# EAGLE design sensorboard_18_v7 (EAGLE 7.7.0)
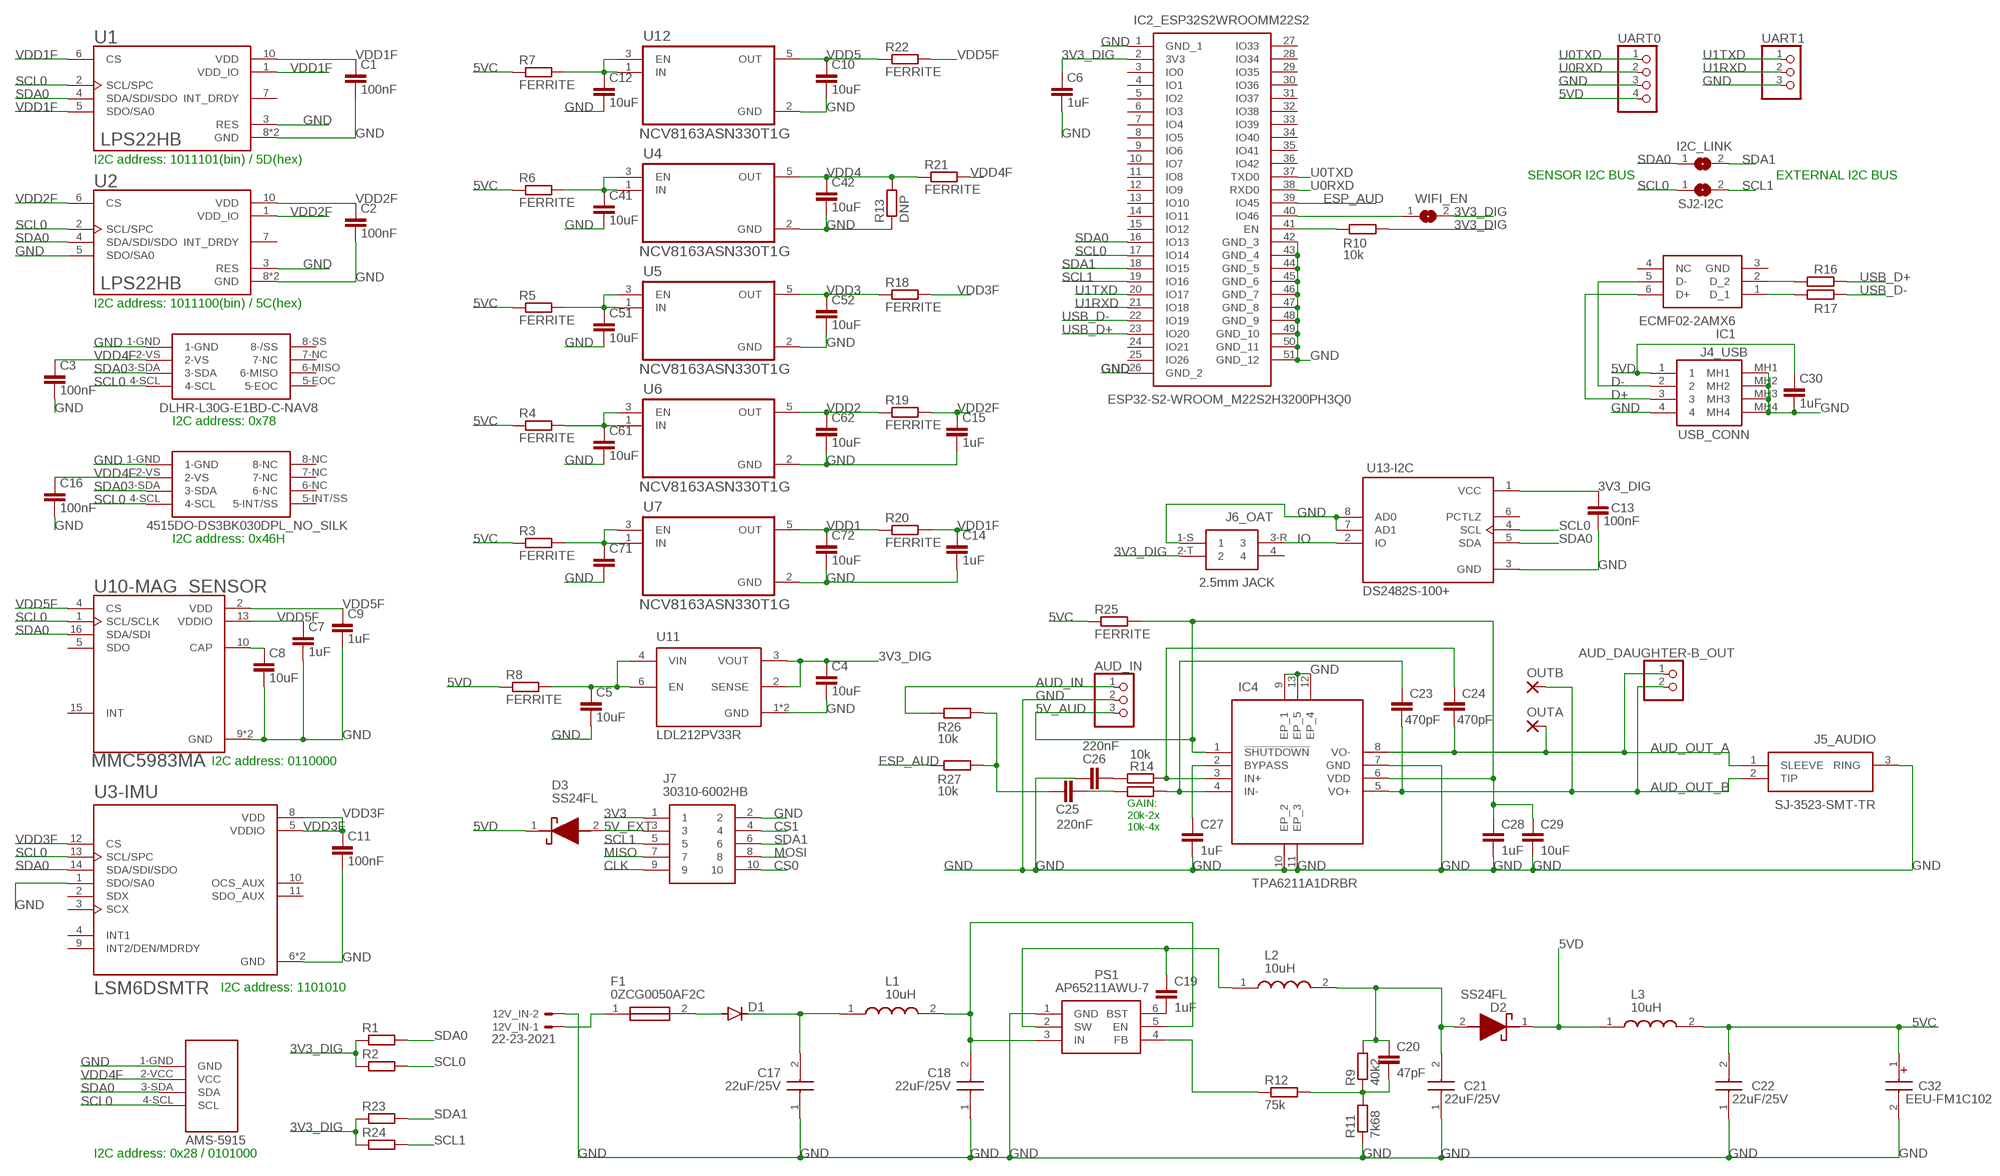
[diagram p0: schematic, sheet 1]

## Parts
12V_IN  22-23-2021  [22-23-2021]
AUD_DAUGHTER-B_OUT  PINHD-1X2  [1X02]
AUD_IN  PINHD-1X3  [1X03]
C1  100nF  C-EUC0603  [C0603]
C2  100nF  C-EUC0603  [C0603]
C3  100nF  C-EUC0805  [C0805]
C4  10uF  C-EUC0805  [C0805]
C5  10uF  C-EUC0805  [C0805]
C6  1uF  C-EUC0805  [C0805]
C7  1uF  C-EUC0805  [C0805]
C8  10uF  C-EUC0805  [C0805]
C9  1uF  C-EUC0805  [C0805]
C10  10uF  C-EUC0805  [C0805]
C11  100nF  C-EUC0805  [C0805]
C12  10uF  C-EUC0805  [C0805]
C13  100nF  C-EUC0805  [C0805]
C14  1uF  C-EUC0805  [C0805]
C15  1uF  C-EUC0805  [C0805]
C16  100nF  C-EUC0805  [C0805]
C17  22uF/25V  CL31A226KAHNNNE  [CAPC3216X180N]
C18  22uF/25V  CL31A226KAHNNNE  [CAPC3216X180N]
C19  1uF  C-EUC0805  [C0805]
C20  47pF  C-EUC0805  [C0805]
C21  22uF/25V  CL31A226KAHNNNE  [CAPC3216X180N]
C22  22uF/25V  CL31A226KAHNNNE  [CAPC3216X180N]
C23  470pF  C-EUC0805  [C0805]
C24  470pF  C-EUC0805  [C0805]
C25  220nF  C-EUC1206  [C1206]
C26  220nF  C-EUC1206  [C1206]
C27  1uF  C-EUC1206  [C1206]
C28  1uF  C-EUC1206  [C1206]
C29  10uF  C-EUC1206  [C1206]
C30  1uF  C-EUC0805  [C0805]
C32  EEU-FM1C102  [CAPPRD500W65D1000H2200]
C41  10uF  C-EUC0805  [C0805]
C42  10uF  C-EUC0805  [C0805]
C51  10uF  C-EUC0805  [C0805]
C52  10uF  C-EUC0805  [C0805]
C61  10uF  C-EUC0805  [C0805]
C62  10uF  C-EUC0805  [C0805]
C71  C-EUC0805  [C0805]
C72  10uF  C-EUC0805  [C0805]
D1  DIODE-DO-214AC  [DO-214AC]
D2  SS24FL  [SODFL3617X108N]
D3  SS24FL  [SODFL3617X108N]
DLHR-L30G-E1BD-C-NAV8  DLHR-L30G-E1BD-C-NAV8  [DLHR-L30G-E1BD-C-NAV8]
F1  0ZCG0050AF2C  [FUSC4632X75N]
I2C_LINK  SJ  [SJ]
IC1  ECMF02-2AMX6  [SON50P150X170X55-6N]
IC2_ESP32S2WROOMM22S2  ESP32-S2-WROOM_M22S2H3200PH3Q0  [ESP32S2WROOMM22S2H3200PH3Q0]
IC4  TPA6211A1DRBR  [TPS7A8033DRBT]
J4_USB  USB_CONN  73725-0110BLF  [737250110BLF]
J5_AUDIO  SJ-3523-SMT-TR  [SJ3523SMTTR]
J6_OAT  2.5mm JACK  SJ-2523-SMT-TR  [SJ-2523-SMT-TR]
J7  30310-6002HB  [SHDR10W64P254_2X5_2030X878X930]
L1  10uH  FDSD0420-H-100M=P3  [FDSD0420WH150MP3]
L2  10uH  FDSD0420-H-100M=P3  [FDSD0420WH150MP3]
L3  10uH  FDSD0420-H-100M=P3  [FDSD0420WH150MP3]
OUTA  SMD2_SMALLSMALL  [SMD2_SMALL]
OUTB  SMD2_SMALLSMALL  [SMD2_SMALL]
PS1  AP65211AWU-7  [SOT95P280X90-6N]
R1  R-EU_R0805  [R0805]
R2  R-EU_R0805  [R0805]
R3  FERRITE  R-EU_R0805  [R0805]
R4  FERRITE  R-EU_R0805  [R0805]
R5  FERRITE  R-EU_R0805  [R0805]
R6  FERRITE  R-EU_R0805  [R0805]
R7  FERRITE  R-EU_R0805  [R0805]
R8  FERRITE  R-EU_R0805  [R0805]
R9  40k2  R-EU_R0805  [R0805]
R10  10k  R-EU_R0805  [R0805]
R11  7k68  R-EU_R0805  [R0805]
R12  75k  R-EU_R0805  [R0805]
R13  DNP  R-EU_R0805  [R0805]
R14  10k  R-EU_R0805  [R0805]
R15  R-EU_R0805  [R0805]
R16  R-EU_R0805  [R0805]
R17  R-EU_R0805  [R0805]
R18  FERRITE  R-EU_R0805  [R0805]
R19  FERRITE  R-EU_R0805  [R0805]
R20  FERRITE  R-EU_R0805  [R0805]
R21  FERRITE  R-EU_R0805  [R0805]
R22  FERRITE  R-EU_R0805  [R0805]
R23  R-EU_R0805  [R0805]
R24  R-EU_R0805  [R0805]
R25  FERRITE  R-EU_R0805  [R0805]
R26  10k  R-EU_R0805  [R0805]
R27  10k  R-EU_R0805  [R0805]
SJ2-I2C  SJ  [SJ]
U1  LPS22HB  [LGA10R50P2X3_200X200X80]
U2  LPS22HB  [LGA10R50P2X3_200X200X80]
U3-IMU  LSM6DSMTR  [PQFN50P300X250X86-14N]
U4  NCV8163ASN330T1G  [SOP95P275X110-5N]
U5  NCV8163ASN330T1G  [SOP95P275X110-5N]
U6  NCV8163ASN330T1G  [SOP95P275X110-5N]
U7  NCV8163ASN330T1G  [SOP95P275X110-5N]
U10-MAG_SENSOR  MMC5983MA  [LGA16R50P4X4_330X330X100]
U11  LDL212PV33R  [SON50P200X200X80-7N]
U12  NCV8163ASN330T1G  [SOP95P275X110-5N]
U13-I2C  DS2482S-100+  [SOIC127P600X175-8N]
U$1  AMS-5915  [AMS-5915]
U$4  4515DO-DS3BK030DPL_NO_SILKNO_SILK  [4515DO-DS3BK030DPL_NO_SILK]
UART0  PINHD-1X4  [1X04]
UART1  PINHD-1X3  [1X03]
WIFI_EN  SJ  [SJ]

## Nets
3V3: J7.1
3V3_DIG: C4.1 C6.1 C13.1 IC2_ESP32S2WROOMM22S2.2(3V3) J6_OAT.2-T R1.1 R2.1 R10.2 R23.1 R24.1 U11.2(SENSE) U11.3(VOUT) U13-I2C.1(VCC) WIFI_EN.2
5V_AUD: AUD_IN.3 C28.1 C29.1 IC4.1(!SHUTDOWN) IC4.6(VDD) R25.2
5V_EXT: D3.2(A) J7.3
5VC: C22.2 C32.1(+) L3.2 R3.1 R4.1 R5.1 R6.1 R7.1 R25.1
5VD: C30.1 D2.1(K) D3.1(K) J4_USB.1 L3.1 R8.1 UART0.4
AUD_IN: AUD_IN.1 R26.1
AUD_OUT_A: AUD_DAUGHTER-B_OUT.1 C24.2 IC4.8(VO-) J5_AUDIO.1(SLEEVE) OUTA.1(P)
AUD_OUT_B: AUD_DAUGHTER-B_OUT.2 C23.2 IC4.5(VO+) J5_AUDIO.2(TIP) OUTB.1(P)
CLK: J7.9
CS0: J7.10
CS1: J7.4
D+: IC1.6(D+) J4_USB.3
D-: IC1.5(D-) J4_USB.2
ESP_AUD: IC2_ESP32S2WROOMM22S2.39(IO45) R27.1
GND: 12V_IN.2 AUD_IN.2 C1.2 C2.2 C3.2 C4.2 C5.2 C6.2 C7.2 C8.2 C9.2 C10.2 C11.2 C12.2 C13.2 C14.2 C15.2 C16.2 C17.1 C18.1 C21.1 C22.1 C26.1 C27.2 C28.2 C29.2 C30.2 C32.2(-) C41.2 C42.2 C51.2 C52.2 C61.2 C62.2 C71.2 C72.2 DLHR-L30G-E1BD-C-NAV8.1-GND IC2_ESP32S2WROOMM22S2.1(GND_1) IC2_ESP32S2WROOMM22S2.26(GND_2) IC2_ESP32S2WROOMM22S2.42(GND_3) IC2_ESP32S2WROOMM22S2.43(GND_4) IC2_ESP32S2WROOMM22S2.44(GND_5) IC2_ESP32S2WROOMM22S2.45(GND_6) IC2_ESP32S2WROOMM22S2.46(GND_7) IC2_ESP32S2WROOMM22S2.47(GND_8) IC2_ESP32S2WROOMM22S2.48(GND_9) IC2_ESP32S2WROOMM22S2.49(GND_10) IC2_ESP32S2WROOMM22S2.50(GND_11) IC2_ESP32S2WROOMM22S2.51(GND_12) IC4.7(GND) IC4.9(EP_1) IC4.10(EP_2) IC4.11(EP_3) IC4.12(EP_4) IC4.13(EP_5) J4_USB.4 J4_USB.MH1 J4_USB.MH2 J4_USB.MH3 J4_USB.MH4 J5_AUDIO.3(RING) J6_OAT.1-S J7.2 PS1.1(GND) R11.1 R13.1 U1.3(RES) U1.8(GND) U1.9(GND) U2.3(RES) U2.5(SDO/SA0) U2.8(GND) U2.9(GND) U3-IMU.1(SDO/SA0) U3-IMU.6(GND) U3-IMU.7(GND) U4.2(GND) U5.2(GND) U6.2(GND) U7.2(GND) U10-MAG_SENSOR.9(GND) U10-MAG_SENSOR.11(GND) U11.1(GND) U11.7(GND) U12.2(GND) U13-I2C.3(GND) U13-I2C.7(AD1) U13-I2C.8(AD0) U$1.1-GND(GND) U$4.1-GND UART0.3 UART1.3
IO: J6_OAT.3-R U13-I2C.2(IO)
MISO: J7.7
MOSI: J7.8
N$2: C8.1 U10-MAG_SENSOR.10(CAP)
N$7: IC2_ESP32S2WROOMM22S2.41(EN) R10.1
N$8: C23.1 IC4.4(IN-) R15.2
N$9: C17.2 D1.C L1.1
N$13: C18.2 L1.2 PS1.3(IN) PS1.5(EN)
N$15: C25.1 R26.2 R27.2
N$16: C20.2 R9.1 R11.2 R12.2
N$17: C19.1 L2.1 PS1.2(SW)
N$18: PS1.4(FB) R12.1
N$20: C19.2 PS1.6(BST)
N$21: C24.1 IC4.3(IN+) R14.2
N$22: C26.2 R14.1
N$23: C25.2 R15.1
N$24: 12V_IN.1 F1.1
N$25: IC2_ESP32S2WROOMM22S2.40(IO46) WIFI_EN.1
N$26: C27.1 IC4.2(BYPASS)
N$27: IC1.1(D_1) R17.1
N$28: IC1.2(D_2) R16.1
N$32: D1.A F1.2
N$33: C20.1 C21.2 D2.2(A) L2.2 R9.2
SCL0: DLHR-L30G-E1BD-C-NAV8.4-SCL IC2_ESP32S2WROOMM22S2.17(IO14) R2.2 SJ2-I2C.1 U1.2(SCL/SPC) U2.2(SCL/SPC) U3-IMU.13(SCL/SPC) U10-MAG_SENSOR.1(SCL/SCLK) U13-I2C.4(SCL) U$1.4-SCL(SCL) U$4.4-SCL
SCL1: IC2_ESP32S2WROOMM22S2.19(IO16) J7.5 R24.2 SJ2-I2C.2
SDA0: DLHR-L30G-E1BD-C-NAV8.3-SDA I2C_LINK.1 IC2_ESP32S2WROOMM22S2.16(IO13) R1.2 U1.4(SDA/SDI/SDO) U2.4(SDA/SDI/SDO) U3-IMU.14(SDA/SDI/SDO) U10-MAG_SENSOR.16(SDA/SDI) U13-I2C.5(SDA) U$1.3-SDA(SDA) U$4.3-SDA
SDA1: I2C_LINK.2 IC2_ESP32S2WROOMM22S2.18(IO15) J7.6 R23.2
U0RXD: IC2_ESP32S2WROOMM22S2.38(RXD0) UART0.2
U0TXD: IC2_ESP32S2WROOMM22S2.37(TXD0) UART0.1
U1RXD: IC2_ESP32S2WROOMM22S2.21(IO18) UART1.2
U1TXD: IC2_ESP32S2WROOMM22S2.20(IO17) UART1.1
USB_D+: IC2_ESP32S2WROOMM22S2.23(IO20) R16.2
USB_D-: IC2_ESP32S2WROOMM22S2.22(IO19) R17.2
VDD1: C72.1 R20.1 U7.5(OUT)
VDD1F: C1.1 C14.1 R20.2 U1.1(VDD_IO) U1.5(SDO/SA0) U1.6(CS) U1.10(VDD)
VDD1P: C71.1 R3.2 U7.1(IN) U7.3(EN)
VDD2: C62.1 R19.1 U6.5(OUT)
VDD2F: C2.1 C15.1 R19.2 U2.1(VDD_IO) U2.6(CS) U2.10(VDD)
VDD2P: C61.1 R4.2 U6.1(IN) U6.3(EN)
VDD3: C52.1 R18.1 U5.5(OUT)
VDD3F: C11.1 R18.2 U3-IMU.5(VDDIO) U3-IMU.8(VDD) U3-IMU.12(CS)
VDD3P: C51.1 R5.2 U5.1(IN) U5.3(EN)
VDD4: C42.1 R13.2 R21.1 U4.5(OUT)
VDD4F: C3.1 C16.1 DLHR-L30G-E1BD-C-NAV8.2-VS R21.2 U$1.2-VCC(VCC) U$4.2-VS
VDD4P: C41.1 R6.2 U4.1(IN) U4.3(EN)
VDD5: C10.1 R22.1 U12.5(OUT)
VDD5F: C7.1 C9.1 R22.2 U10-MAG_SENSOR.2(VDD) U10-MAG_SENSOR.4(CS) U10-MAG_SENSOR.13(VDDIO)
VDD5P: C12.1 R7.2 U12.1(IN) U12.3(EN)
VDD_DIGP: C5.1 R8.2 U11.4(VIN) U11.6(EN)
Unconnected: DLHR-L30G-E1BD-C-NAV8.5-EOC DLHR-L30G-E1BD-C-NAV8.6-MISO DLHR-L30G-E1BD-C-NAV8.7-NC DLHR-L30G-E1BD-C-NAV8.8-SS(8-/SS) IC1.4(NC) IC2_ESP32S2WROOMM22S2.3(IO0) IC2_ESP32S2WROOMM22S2.4(IO1) IC2_ESP32S2WROOMM22S2.5(IO2) IC2_ESP32S2WROOMM22S2.6(IO3) IC2_ESP32S2WROOMM22S2.7(IO4) IC2_ESP32S2WROOMM22S2.8(IO5) IC2_ESP32S2WROOMM22S2.9(IO6) IC2_ESP32S2WROOMM22S2.10(IO7) IC2_ESP32S2WROOMM22S2.11(IO8) IC2_ESP32S2WROOMM22S2.12(IO9) IC2_ESP32S2WROOMM22S2.13(IO10) IC2_ESP32S2WROOMM22S2.14(IO11) IC2_ESP32S2WROOMM22S2.15(IO12) IC2_ESP32S2WROOMM22S2.24(IO21) IC2_ESP32S2WROOMM22S2.25(IO26) IC2_ESP32S2WROOMM22S2.27(IO33) IC2_ESP32S2WROOMM22S2.28(IO34) IC2_ESP32S2WROOMM22S2.29(IO35) IC2_ESP32S2WROOMM22S2.30(IO36) IC2_ESP32S2WROOMM22S2.31(IO37) IC2_ESP32S2WROOMM22S2.32(IO38) IC2_ESP32S2WROOMM22S2.33(IO39) IC2_ESP32S2WROOMM22S2.34(IO40) IC2_ESP32S2WROOMM22S2.35(IO41) IC2_ESP32S2WROOMM22S2.36(IO42) J6_OAT.4 U1.7(INT_DRDY) U2.7(INT_DRDY) U3-IMU.2(SDX) U3-IMU.3(SCX) U3-IMU.4(INT1) U3-IMU.9(INT2/DEN/MDRDY) U3-IMU.10(OCS_AUX) U3-IMU.11(SDO_AUX) U10-MAG_SENSOR.5(SDO) U10-MAG_SENSOR.15(INT) U13-I2C.6(PCTLZ) U$4.5-INT/SS U$4.6-NC U$4.7-NC U$4.8-NC

## Notes on the sheet
- I2C address: 1011101(bin) / 5D(hex)
- SENSOR I2C BUS | EXTERNAL I2C BUS
- I2C address: 1011100(bin) / 5C(hex)
- I2C address: 0x78
- I2C address: 0x46H
- I2C address: 0110000
- GAIN:
  20k-2x
  10k-4x
- I2C address: 1101010
- I2C address: 0x28 / 0101000

## Power pins joined to a net without a drawn wire
GND: IC1.3(GND)

## Library data of the parts
12V_IN = con-molex:22-23-2021: .100" (2.54mm) Center Header - 2 Pin; MF: MOLEX; MPN: 22-23-2021; OC_FARNELL: 1462926; OC_NEWARK: 25C3832
AUD_DAUGHTER-B_OUT = pinhead:PINHD-1X2: PIN HEADER
AUD_IN UART1 = pinhead:PINHD-1X3: PIN HEADER
C1-C16 C19 C20 C23-C30 C41 C42 C51 C52 C61 C62 C71 C72 = rcl:C-EU: CAPACITOR, European symbol; SPICEPREFIX: C
C17 C18 C21 C22 = SamacSys_Parts:CL31A226KAHNNNE: SAMSUNG ELECTRO-MECHANICS - CL31A226KAHNNNE - CAP, 22UF, 25V, MLCC, 1206 Source: Datasheet <http://www.samsungsem.com/kr/support/product-search/mlcc/CL31A226KAHNNNE.jsp>; DESCRIPTION: SAMSUNG ELECTRO-MECHANICS - CL31A226KAHNNNE - CAP, 22UF, 25V, MLCC, 1206; HEIGHT: 1.8mm; MANUFACTURER_NAME: Samsung Electro-Mechanics; MANUFACTURER_PART_NUMBER: CL31A226KAHNNNE; MOUSER_PART_NUMBER: N/A; MOUSER_PRICE-STOCK: https://www.mouser.com/Search/Refine.aspx?Keyword=N%2FA
C32 = SamacSys_Parts:EEU-FM1C102: Al Electrolytic Cap 105C 16V 1000uF Panasonic 1000uF 16 V dc Aluminium Electrolytic Capacitor, FM Series 5000h 10 Dia. x 20mm Source: Datasheet <http://industrial.panasonic.com/cdbs/www-data/pdf/RDF0000/ABA0000C1018.pdf>; DESCRIPTION: Al Electrolytic Cap 105C 16V 1000uF Panasonic 1000uF 16 V dc Aluminium Electrolytic Capacitor, FM Series 5000h 10 Dia. x 20mm; HEIGHT: 22mm; MANUFACTURER_NAME: Panasonic; MANUFACTURER_PART_NUMBER: EEU-FM1C102; MOUSER_PART_NUMBER: 667-EEU-FM1C102; MOUSER_PRICE-STOCK: https://www.mouser.co.uk/ProductDetail/Panasonic/EEU-FM1C102?qs=MtOUKumLmnZ3b%252BuCdcXLJA%3D%3D
D1 = diode:DIODE-: DIODE
D2 D3 = SamacSys_Parts:SS24FL: ON SEMICONDUCTOR - SS24FL - SCHOTTKY RECT, AEC-Q101, 40V, SOD-123F Source: Datasheet <https://www.onsemi.com/pub/Collateral/SS26FL-D.PDF>; DESCRIPTION: ON SEMICONDUCTOR - SS24FL - SCHOTTKY RECT, AEC-Q101, 40V, SOD-123F; HEIGHT: 1.08mm; MANUFACTURER_NAME: ON Semiconductor; MANUFACTURER_PART_NUMBER: SS24FL; MOUSER_PART_NUMBER: 512-SS24FL; MOUSER_PRICE-STOCK: https://www.mouser.co.uk/ProductDetail/ON-Semiconductor-Fairchild/SS24FL?qs=tqW9UTzndZyvT5hdH%252BfSxg%3D%3D
DLHR-L30G-E1BD-C-NAV8 = pressure_01:DLHR-L30G-E1BD-C-NAV8; DLHR-L30G-E1BD-C-NAV8: DLHR-L30G-E1BD-C-NAV8
F1 = SamacSys_Parts:0ZCG0050AF2C: Resettable Fuses - PPTC Fuse Source: Datasheet <http://belfuse.com/pdfs/0ZCG.pdf>; DESCRIPTION: Resettable Fuses - PPTC Fuse; HEIGHT: 0.75mm; MANUFACTURER_NAME: Stewart Connector; MANUFACTURER_PART_NUMBER: 0ZCG0050AF2C; MOUSER_PART_NUMBER: 530-0ZCG0050AF2C; MOUSER_PRICE-STOCK: https://www.mouser.co.uk/ProductDetail/Bel-Fuse/0ZCG0050AF2C?qs=SRYZG9HaIQ0mNZjboPT99Q%3D%3D
I2C_LINK SJ2-I2C WIFI_EN = jumper:SJ: SMD solder JUMPER
IC1 = ECMF02-2AMX6:ECMF02-2AMX6: Common Mode Filter & ESD Prot. USB uQFN6 STMicroelectronics ECMF02 Series, Signal Filter, 200mA uQFN SMD, Flat Contact Termination, 1.8 x 1.6 x 0.5mm Source: Datasheet <http://www.st.com/content/ccc/resource/technical/document/datasheet/3a/28/cf/d0/31/63/48/8c/CD00282307.pdf/files/CD00282307.pdf/jcr:content/translations/en.CD00282307.pdf> Check prices <https://pricing.snapeda.com/parts/ECMF02-2AMX6/STMicroelectronics/view-part?ref=eda>; AVAILABILITY: Good; DESCRIPTION: 2 Line Common Mode Choke Surface Mount 200mA DCR 2.5Ohm; MF: STMicroelectronics; MP: ECMF02-2AMX6; PACKAGE: UFQFN-6 STMicroelectronics; PRICE: None; PURCHASE-URL: https://pricing.snapeda.com/search/part/ECMF02-2AMX6/?ref=eda
IC2_ESP32S2WROOMM22S2 = SamacSys_Parts:ESP32-S2-WROOM_M22S2H3200PH3Q0: WiFi Modules (802.11) Module ESP32-S2 WROOM PCB ANT Source: Datasheet; DESCRIPTION: WiFi Modules (802.11) Module ESP32-S2 WROOM PCB ANT; HEIGHT: 3.45mm; MANUFACTURER_NAME: Espressif Systems; MANUFACTURER_PART_NUMBER: ESP32-S2-WROOM(M22S2H3200PH3Q0); MOUSER_PART_NUMBER: 356-ESP32S2WRM3200PH; MOUSER_PRICE-STOCK: https://www.mouser.co.uk/ProductDetail/Espressif-Systems/ESP32-S2-WROOMM22S2H3200PH3Q0?qs=vHuUswq2%252BsxRlbezmiT%252B3g%3D%3D
IC4 = SamacSys_Parts:TPA6211A1DRBR: 3.1-W Mono, Fully Differential, Class-AB Audio Amplifier Source: Datasheet <http://www.ti.com/lit/gpn/tpa6211a1>; DESCRIPTION: 3.1-W Mono, Fully Differential, Class-AB Audio Amplifier; HEIGHT: 1mm; MANUFACTURER_NAME: Texas Instruments; MANUFACTURER_PART_NUMBER: TPA6211A1DRBR; MOUSER_PART_NUMBER: 595-TPA6211A1DRBR; MOUSER_PRICE-STOCK: https://www.mouser.co.uk/ProductDetail/Texas-Instruments/TPA6211A1DRBR?qs=ojKcPFmCWSW40Vo7DG%2FXvg%3D%3D
J4_USB = SamacSys_Parts:73725-0110BLF: USB Connectors USB UP RIGHT RECEP W/O SENSOR FLAG Source: Datasheet; DESCRIPTION: USB Connectors USB UP RIGHT RECEP W/O SENSOR FLAG; HEIGHT: 14.03mm; MANUFACTURER_NAME: Amphenol; MANUFACTURER_PART_NUMBER: 73725-0110BLF; MOUSER_PART_NUMBER: 649-73725-0110BLF; MOUSER_PRICE-STOCK: https://www.mouser.co.uk/ProductDetail/Amphenol-FCI/73725-0110BLF?qs=x6EjVpvqMVP%252BaDTVID3rTA%3D%3D
J5_AUDIO = SamacSys_Parts:SJ-3523-SMT-TR: Phone Connectors Audio Jacks Source: Datasheet <https://www.mouser.de/datasheet/2/670/sj_352x_smt-1779397.pdf>; DESCRIPTION: Phone Connectors Audio Jacks; HEIGHT: 5.2mm; MANUFACTURER_NAME: CUI Devices; MANUFACTURER_PART_NUMBER: SJ-3523-SMT-TR; MOUSER_PART_NUMBER: 490-SJ-3523-SMT-TR; MOUSER_PRICE-STOCK: https://www.mouser.co.uk/ProductDetail/CUI-Devices/SJ-3523-SMT-TR?qs=WyjlAZoYn51zOHzJ3r4ZRA%3D%3D
J6_OAT = SamacSys_Parts:SJ-2523-SMT-TR: 2.5 MM AUDIO JACK Source: Datasheet <http://www.cui.com/product/resource/digikeypdf/sj-252x-smt_series.pdf>; DESCRIPTION: 2.5 MM AUDIO JACK; HEIGHT: mm; MANUFACTURER_NAME: CUI Devices; MANUFACTURER_PART_NUMBER: SJ-2523-SMT-TR; MOUSER_PART_NUMBER: 490-SJ-2523-SMT-TR; MOUSER_PRICE-STOCK: https://www.mouser.co.uk/ProductDetail/CUI-Devices/SJ-2523-SMT-TR?qs=WyjlAZoYn50TRxpi%2FhdHvw%3D%3D
J7 = SamacSys_Parts:30310-6002HB: Headers & Wire Housings 10P STRT 4WALL GLDFL Source: Datasheet <http://multimedia.3m.com/mws/media/22504O/3mtm-100-in-loprof-hdr-100x-100strt-ra-4-wall-ts0818.pdf>; DESCRIPTION: Headers & Wire Housings 10P STRT 4WALL GLDFL; HEIGHT: 9.3mm; MANUFACTURER_NAME: 3M; MANUFACTURER_PART_NUMBER: 30310-6002HB; MOUSER_PART_NUMBER: 517-30310-6002; MOUSER_PRICE-STOCK: https://www.mouser.co.uk/ProductDetail/3M-Electronic-Solutions-Division/30310-6002HB?qs=Z%252B4xWyzEAtfC1LW5U6u5VQ%3D%3D
L1-L3 = SamacSys_Parts:FDSD0420-H-100M=P3: Toko FDSD0420 Series Shielded Wire-wound SMD Inductor with a Powered Iron Core, 10 uH Wire-Wound 3.3A Idc Source: Datasheet <https://psearch.en.murata.com/inductor/product/FDSD0420-H-100M#.html>; DESCRIPTION: Toko FDSD0420 Series Shielded Wire-wound SMD Inductor with a Powered Iron Core, 10 uH Wire-Wound 3.3A Idc; HEIGHT: 2mm; MANUFACTURER_NAME: Murata Electronics; MANUFACTURER_PART_NUMBER: FDSD0420-H-100M=P3; MOUSER_PART_NUMBER: 81-FDSD0420-H-100MP3; MOUSER_PRICE-STOCK: https://www.mouser.co.uk/ProductDetail/Murata-Electronics/FDSD0420-H-100M%3dP3?qs=KuGPmAKtFKXZ0m3Q9jeEIg%3D%3D
OUTA OUTB = wirepad_SMALL:SMD2_SMALL: SMD PAD
PS1 = SamacSys_Parts:AP65211AWU-7: Switching Voltage Regulators DCDC Conv HV Buck Source: Datasheet <https://componentsearchengine.com/Datasheets/1/AP65211AWU-7.pdf>; DESCRIPTION: Switching Voltage Regulators DCDC Conv HV Buck; HEIGHT: 0.9mm; MANUFACTURER_NAME: Diodes Inc.; MANUFACTURER_PART_NUMBER: AP65211AWU-7; MOUSER_PART_NUMBER: 621-AP65211AWU-7; MOUSER_PRICE-STOCK: https://www.mouser.co.uk/ProductDetail/Diodes-Incorporated/AP65211AWU-7?qs=HXFqYaX1Q2yDqQLsq3DZAg%3D%3D
R1-R27 = rcl:R-EU_: RESISTOR, European symbol; SPICEPREFIX: R
U1 U2 = LPS22HB:LPS22HB: MEMS nano pressure sensor: 260-1260 hPa absolute digital output barometer; AVAILABILITY: Unavailable; DESCRIPTION: Pressure Sensor 3.77PSI ~ 18.27PSI (26kPa ~ 126kPa) Absolute 24 b 10-WFLGA Exposed Pad; MF: STMicroelectronics; MP: LPS22HB; PACKAGE: WFLGA-10 STMicroelectronics; PRICE: None
U3-IMU = LSM6DSMTR:LSM6DSMTR: iNEMO inertial module: 3D accelerometer and 3D gyroscope Check prices <https://snapeda.com/parts/LSM6DSMTR/STMicroelectronics/view-part/?ref=eda>; ARROW_ELECTRONICS-PURCHASE-URL: https://snapeda.com/shop?store=Arrow+Electronics&id=581716; AVAILABILITY: Good; DESCRIPTION: Accelerometer, Gyroscope, Temperature, 6 Axis Sensor I²C, SPI Output; DIGIKEY-PURCHASE-URL: https://snapeda.com/shop?store=DigiKey&id=581716; MF: STMicroelectronics; MOUSER-PURCHASE-URL: https://snapeda.com/shop?store=Mouser&id=581716; MP: LSM6DSMTR; PACKAGE: VFLGA-14 STMicroelectronics; PRICE: None
U4-U7 U12 = NCV8163ASN330T1G:NCV8163ASN330T1G: None Check prices <https://snapeda.com/parts/NCV8163ASN330T1G/ON%20Semiconductor/view-part/?ref=eda>; AVAILABILITY: Warning; DESCRIPTION: Linear Voltage Regulator IC 1 Output 250mA 5-TSOP; MF: ON Semiconductor; MOUSER-PURCHASE-URL: https://snapeda.com/shop?store=Mouser&id=3218317; MP: NCV8163ASN330T1G; PACKAGE: TSOP-5 ON Semiconductor; PRICE: None
U10-MAG_SENSOR = FIS1100:MMC5983MA: MMC5983MA Magnetometer; ARROW_ELECTRONICS-PURCHASE-URL: https://snapeda.com/shop?store=Arrow+Electronics&id=1392125; AVAILABILITY: Good; DESCRIPTION: Accelerometer, Gyroscope, 6 Axis Sensor I²C Output; DIGIKEY-PURCHASE-URL: https://snapeda.com/shop?store=DigiKey&id=1392125; MF: ON Semiconductor; MP: FIS1100; PACKAGE: VFLGA-16 ON Semiconductor; PRICE: None
U11 = LDL212PV33R:LDL212PV33R: Linear Voltage Regulator IC 1 Output 1.2A 6-DFN (2x2) Check prices <https://snapeda.com/parts/LDL212PV33R/STMicroelectronics/view-part/?ref=eda>; ARROW_ELECTRONICS-PURCHASE-URL: https://snapeda.com/shop?store=Arrow+Electronics&id=4551149; AVAILABILITY: Good; DESCRIPTION: Linear Voltage Regulator IC 1 Output 1.2A 6-DFN (2x2); DIGIKEY-PURCHASE-URL: https://snapeda.com/shop?store=DigiKey&id=4551149; MF: STMicroelectronics; MOUSER-PURCHASE-URL: https://snapeda.com/shop?store=Mouser&id=4551149; MP: LDL212PV33R; PACKAGE: DFN-6 STMicroelectronics; PRICE: None
U13-I2C = DS2482S-100_:DS2482S-100+: DS2460S Series 5.5 V 400 kHz I2C Surface Mount Smart Card Interface IC - SOIC-8 Check prices <https://snapeda.com/parts/DS2482S-100%2B/Maxim%20Integrated/view-part/?ref=eda>; AVAILABILITY: Warning; DESCRIPTION: 1-Wire® Bridge, 1-Wire® to I²C I²C Interface 8-SOIC; DIGIKEY-PURCHASE-URL: https://snapeda.com/shop?store=DigiKey&id=587620; MF: Maxim Integrated; MOUSER-PURCHASE-URL: https://snapeda.com/shop?store=Mouser&id=587620; MP: DS2482S-100+; PACKAGE: SOIC-8 Maxim; PRICE: None
U$1 = pressure_01:AMS-5915
U$4 = pressure_01:4515DO-DS3BK030DPL_NO_SILK
UART0 = pinhead:PINHD-1X4: PIN HEADER

## Board
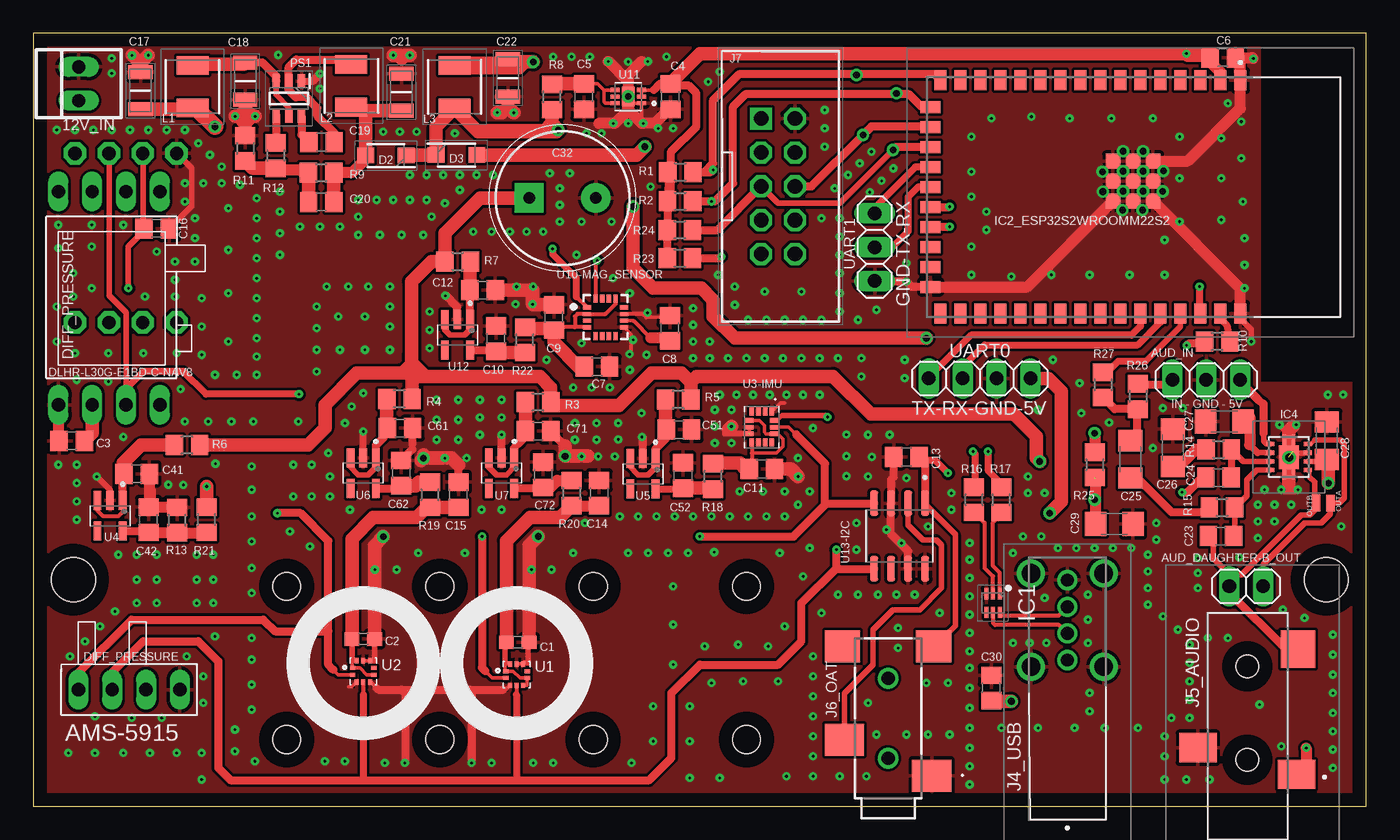
[diagram p1: board, top side]
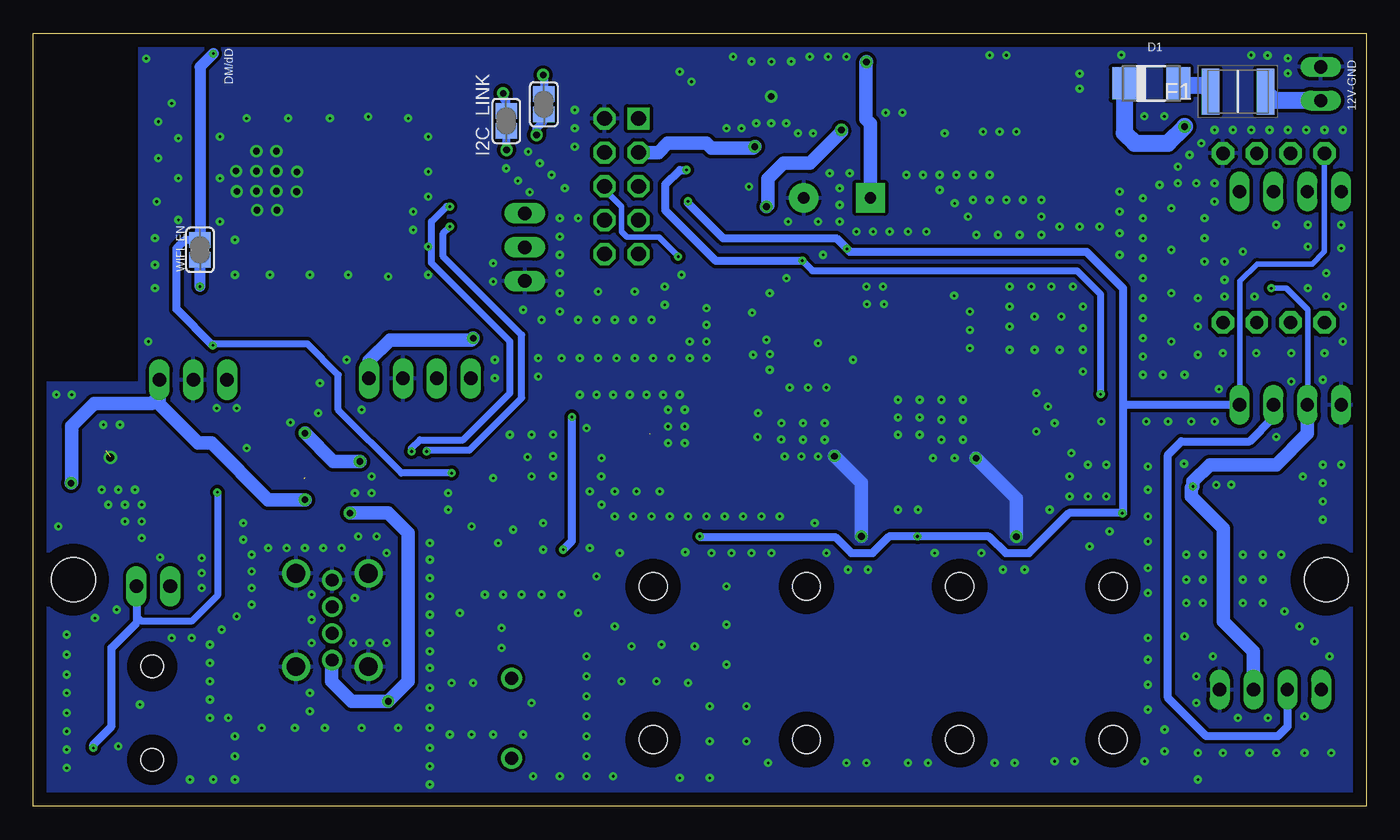
[diagram p2: board, bottom side, seen from below]

Size 100 x 58 mm. Coordinates in mm from the lower left corner, seen from the top.
Outline: 0,0 100,0 100,58 0,58 0,0
Copper layers (1*16): Top 0.035mm / dielectric 1.5mm / Bottom 0.035mm
Design rules "default *": minimum track width 10mil, minimum drill 24mil, track to track 0.149859375mm, track to pad 0.149859375mm, pad to pad 0.149859375mm, via to via 6mil, smd to smd 6mil, copper to edge 40mil, drill to drill 8mil, minimum pad ring 10mil, minimum via ring 8mil, stop-mask expansion 4mil, vias tented up to drill 0.45875mm, thermal gap 10mil
Holes 2.1 mm at 19,5 30.5,5 42,5 53.5,5 19,16.5 30.5,16.5 42,16.5 53.5,16.5
Holes 3.3 mm at 3,17 97,17

### Footprints (pad centres in the part's own frame; a part is rotated, then mirrored left to right if it is on the bottom)
22-23-2021 = drill 1 long: 1 -1.27,0; 2 1.27,0
1X02 = drill 1.016 long: 1 -1.27,0; 2 1.27,0
1X03 = drill 1.016 long: 1 -2.54,0; 2 0,0; 3 2.54,0
C0603 = smd 1.1 x 1: 1 -0.85,0; 2 0.85,0
C0805 = smd 1.3 x 1.5: 1 -0.95,0; 2 0.95,0
CAPC3216X180N = smd 1.05 x 1.82: 1 -1.39,0; 2 1.39,0
C1206 = smd 1.6 x 1.8: 1 -1.4,0; 2 1.4,0
CAPPRD500W65D1000H2200 = drill 0.85 pad 2.184 square: 1 0,0 | drill 0.85 pad 2.184: 2 5,0
DO-214AC = smd 1.8 x 2.4: A 2.025,0; C -2.025,0
SODFL3617X108N = smd 1.26 x 1.17: 1 -1.525,0; 2 1.525,0
DLHR-L30G-E1BD-C-NAV8 = drill 1 pad 1.422 long: 1-GND 0,0; 2-VS 0,-2.54; 3-SDA 0,-5.08; 4-SCL 0,-7.62; 5-EOC 16,-7.62; 6-MISO 16,-5.08; 7-NC 16,-2.54; 8-SS 16,0
FUSC4632X75N = smd 1.32 x 3.43: 1 -2.06,0; 2 2.06,0
SJ = smd 1.168 x 1.6: 1 -0.762,0; 2 0.762,0
SON50P150X170X55-6N = smd 0.85 x 0.3: 1 -0.7,0.5; 2 -0.7,0; 3 -0.7,-0.5; 4 0.7,-0.5; 5 0.7,0; 6 0.7,0.5
ESP32S2WROOMM22S2H3200PH3Q0 = smd 1.5 x 0.9: 1 -8.75,8; 2 -8.75,6.5; 3 -8.75,5; 4 -8.75,3.5; 5 -8.75,2; 6 -8.75,0.5; 7 -8.75,-1; 8 -8.75,-2.5; 9 -8.75,-4; 10 -8.75,-5.5; 11 -8.75,-7; 12 -8.75,-8.5; 13 -8.75,-10; 14 -8.75,-11.5; 15 -8.75,-13; 16 -8.75,-14.5; 27 8.75,-14.5; 28 8.75,-13; 29 8.75,-11.5; 30 8.75,-10; 31 8.75,-8.5; 32 8.75,-7; 33 8.75,-5.5; 34 8.75,-4; 35 8.75,-2.5; 36 8.75,-1; 37 8.75,0.5; 38 8.75,2; 39 8.75,3.5; 40 8.75,5; 41 8.75,6.5; 42 8.75,8 | smd 0.9 x 1.5: 17 -6.75,-15.25; 18 -5.25,-15.25; 19 -3.75,-15.25; 20 -2.25,-15.25; 21 -0.75,-15.25; 22 0.75,-15.25; 23 2.25,-15.25; 24 3.75,-15.25; 25 5.25,-15.25; 26 6.75,-15.25 | smd 1.1 x 1.1: 43 -1.19,-0.05; 44 -2.69,-0.05; 45 -2.69,-1.55; 46 -1.19,-1.55; 47 0.31,-1.55; 48 0.31,-0.05; 49 0.31,1.45; 50 -1.19,1.45; 51 -2.69,1.45
TPS7A8033DRBT = smd 0.6 x 0.31: 1 -1.4,0.975; 2 -1.4,0.325; 3 -1.4,-0.325; 4 -1.4,-0.975; 5 1.4,-0.975; 6 1.4,-0.325; 7 1.4,0.325; 8 1.4,0.975 | smd 1.5 x 1.75: 9 0,0 | smd 0.23 x 0.825: 10 -0.325,-1.278; 11 0.325,-1.278; 12 0.325,1.278; 13 -0.325,1.278
737250110BLF = drill 0.97 pad 1.509: 1 0,0; 2 0,2; 3 0,4; 4 0,6 | drill 1.4 pad 2.1: MH1 -2.72,6.5; MH2 2.72,6.5; MH3 2.72,-0.5; MH4 -2.72,-0.5
SJ3523SMTTR = smd 2.2 x 2.8: 1 2.4,-3.7; 3 4.4,3.7 | smd 2.8 x 2.6: 2 11.8,-3.8 | hole 1.7: 3.5,0; 10.5,0
SJ-2523-SMT-TR = smd 2.4 x 2.95: 1-S 1.7,-3.275; 3-R 4.4,3.275 | smd 2.4 x 2.65: 2-T 11.4,-3.425; 4 11.4,3.425 | drill 1 pad 1.55: 5 3,0; 6 9,0
SHDR10W64P254_2X5_2030X878X930 = drill 1.1 pad 1.65 square: 1 0,0 | drill 1.1 pad 1.65 octagon: 2 0,2.54; 3 2.54,0; 4 2.54,2.54; 5 5.08,0; 6 5.08,2.54; 7 7.62,0; 8 7.62,2.54; 9 10.16,0; 10 10.16,2.54
FDSD0420WH150MP3 = smd 1.4 x 2.4: 1 -1.6,0; 2 1.6,0
SMD2_SMALL = smd 1.27 x 0.635: 1 0,0
SOT95P280X90-6N = smd 1.05 x 0.55: 1 -1.3,0.95; 2 -1.3,0; 3 -1.3,-0.95; 4 1.3,-0.95; 5 1.3,0; 6 1.3,0.95
R0805 = smd 1.3 x 1.5: 1 -0.95,0; 2 0.95,0
LGA10R50P2X3_200X200X80 = smd 0.4 x 0.3: 1 -0.8,0.25; 2 -0.8,-0.25; 6 0.8,-0.25; 7 0.8,0.25 | smd 0.3 x 0.4: 3 -0.5,-0.8; 4 0,-0.8; 5 0.5,-0.8; 8 0.5,0.8; 9 0,0.8; 10 -0.5,0.8
PQFN50P300X250X86-14N = smd 0.6 x 0.35: 1 -1.16,0.75; 2 -1.16,0.25; 3 -1.16,-0.25; 4 -1.16,-0.75; 8 1.16,-0.75; 9 1.16,-0.25; 10 1.16,0.25; 11 1.16,0.75 | smd 0.35 x 0.6: 5 -0.5,-0.91; 6 0,-0.91; 7 0.5,-0.91; 12 0.5,0.91; 13 0,0.91; 14 -0.5,0.91
SOP95P275X110-5N = smd 1.42 x 0.58: 1 -1.145,0.95; 2 -1.145,0; 3 -1.145,-0.95; 4 1.145,-0.95; 5 1.145,0.95
LGA16R50P4X4_330X330X100 = smd 0.61 x 0.32: 1 -1.395,0.75; 2 -1.395,0.25; 3 -1.395,-0.25; 4 -1.395,-0.75; 9 1.395,-0.75; 10 1.395,-0.25; 11 1.395,0.25; 12 1.395,0.75 | smd 0.32 x 0.61: 5 -0.75,-1.395; 6 -0.25,-1.395; 7 0.25,-1.395; 8 0.75,-1.395; 13 0.75,1.395; 14 0.25,1.395; 15 -0.25,1.395; 16 -0.75,1.395
SON50P200X200X80-7N = smd 0.74 x 0.32: 1 -0.985,0.5; 2 -0.985,0; 3 -0.985,-0.5; 4 0.985,-0.5; 5 0.985,0; 6 0.985,0.5 | smd 0.92 x 1.45: 7 0,0
SOIC127P600X175-8N = smd 1.9 x 0.6: 1 -2.455,1.905; 2 -2.455,0.635; 3 -2.455,-0.635; 4 -2.455,-1.905; 5 2.455,-1.905; 6 2.455,-0.635; 7 2.455,0.635; 8 2.455,1.905
AMS-5915 = drill 1 long: 1-GND 7.62,0; 2-VCC 5.08,0; 3-SDA 2.54,0; 4-SCL 0,0
4515DO-DS3BK030DPL_NO_SILK = drill 1 pad 1.676 octagon: 1-GND 0,0; 2-VS 0,-2.54; 3-SDA 0,-5.08; 4-SCL 0,-7.62; 5-INT/SS 12.7,-7.62; 6-NC 12.7,-5.08; 7-NC 12.7,-2.54; 8-NC 12.7,0
1X04 = drill 1.016 long: 1 -3.81,0; 2 -1.27,0; 3 1.27,0; 4 3.81,0

### Placement (x,y rotation side)
12V_IN  3.4,54.22 90 top
AUD_DAUGHTER-B_OUT  91,16.5 180 top
AUD_IN  88,32 0 top
C1  36.34,12.3 0 top
C2  24.75,12.54 0 top
C3  2.88,27.43 180 top
C4  47.79,53.25 270 top
C5  41.31,53.25 270 top
C6  89.23,56.18 0 top
C7  42.28,32.98 0 top
C8  47.75,35.87 90 top
C9  39.05,36.69 90 top
C10  34.7,35.1 90 top
C11  54.66,25.3 0 top
C12  33.71,38.72 0 top
C13  65.51,26.21 180 top
C14  42.45,23.5 90 top
C15  31.89,23.38 90 top
C16  9.24,43.35 0 top
C17  8.04,53.7 270 top
C18  15.9,54.41 90 top
C19  21.62,49.83 180 top
C20  21.6,45.34 180 top
C21  27.62,53.57 270 top
C22  35.6,54.65 90 top
C23  89.1,20.27 180 top
C24  88.92,24.66 180 top
C25  82.3,26.03 270 top
C26  85.5,26.9 270 top
C27  89.35,28.88 180 top
C28  97.05,27.43 90 top
C29  81.11,21.18 0 top
C30  71.88,8.88 90 top
C32  37.2,45.65 0 top
C41  7.76,24.95 0 top
C42  8.64,21.5 90 top
C51  48.44,28.26 0 top
C52  48.74,24.82 90 top
C61  27.5,28.38 0 top
C62  27.6,25 90 top
C71  37.87,28.15 0 top
C72  38.25,24.88 90 top
D1  16.12,54.25 0 bottom
D2  26.45,48.84 180 top
D3  31.75,48.87 0 top
DLHR-L30G-E1BD-C-NAV8  1.88,30.12 90 top
F1  9.62,53.62 180 bottom
I2C_LINK  61.7,52.67 270 bottom
IC1  72,15.25 270 top
IC2_ESP32S2WROOMM22S2  82.56,45.72 270 top
IC4  94.2,26.2 0 top
J4_USB  77.58,10.96 0 top
J5_AUDIO  91.08,-0.01 90 top
J6_OAT  64.12,0.6 90 top
J7  54.6,51.6 270 top
L1  11.94,53.99 90 top
L2  23.85,54.05 270 top
L3  31.6,53.98 90 top
OUTA  97.31,22.74 90 top
OUTB  96.25,22.75 90 top
PS1  19.17,53.12 270 top
R1  48.55,47.59 0 top
R2  48.53,45.39 0 top
R3  37.87,30.32 180 top
R4  27.47,30.57 180 top
R5  48.38,30.5 180 top
R6  11.53,27.1 180 top
R7  31.83,40.88 0 top
R8  38.91,53.22 90 top
R9  21.59,47.55 0 top
R10  88.81,34.86 180 top
R11  15.91,49.37 270 top
R12  18.19,48.82 270 top
R13  10.78,21.48 270 top
R14  88.92,26.77 0 top
R15  89.17,22.43 0 top
R16  70.58,23 90 top
R17  72.62,23 90 top
R18  51,24.75 90 top
R19  29.75,23.38 270 top
R20  40.38,23.5 270 top
R21  13,21.5 90 top
R22  36.88,35 90 top
R23  48.5,41.12 0 top
R24  48.5,43.25 0 top
R25  79.62,25.62 270 top
R26  82.88,30.75 270 top
R27  80.25,31.62 270 top
SJ2-I2C  64.53,51.42 270 bottom
U1  36.25,9.88 0 top
U2  24.75,10.12 0 top
U3-IMU  54.66,28.45 270 top
U4  5.75,21.8 270 top
U5  45.73,24.94 270 top
U6  24.75,25 270 top
U7  35.12,25 270 top
U10-MAG_SENSOR  42.93,36.69 0 top
U11  44.64,53.25 180 top
U12  31.82,35.38 270 top
U13-I2C  64.99,20.28 270 top
U$1  3.38,8.75 0 top
U$4  10.75,49 270 top
UART0  71,32.1 0 top
UART1  63.12,41.95 270 top
WIFI_EN  87.5,41.75 90 bottom

### Tracks (layer width: path | path; a pad name or v marks a point on that pad's centre or on a via)
3V3_DIG  (via drill 0.2)
  Top 0.254: U11.3 U11.2 | 47.8,54.17 C4.1 | 47.81,54.2 C4.1 | 47.84,54.13 C4.1 | U11.3 45.7,53.75 | 46.55,53.75 U11.3 | C4.1 | 66.89,25.77 C13.1 66.48,26.23
  Top 0.406: U13-I2C.1 66.89,22.69 69.18,20.41 69.18,13.53 J6_OAT.2-T | C4.1 47.79,54.36 | 47,54.2 47.03,54.17
  Top 0.508: C13.1 66.46,26.09 66.58,25.96 67.67,25.96 v68.62,25 | C4.1 47.89,54.1
  Top 0.61: C4.1 47,54.2 46.55,53.75 | 66.89,25.77 U13-I2C.1 | C6.1 88.05,56.18 | R2.1 47.82,45.41 47.82,49.07 49.75,51 49.75,53.5 49.15,54.1 47.89,54.1 | R1.1 47.69,47.58 R2.1 | R10.2 87.72,34.71 86.66,34.71 v86.53,34.58 | R2.1 47.59,43.28 R24.1 R23.1 | 47.79,54.36 47.83,54.4 | 47.03,54.17 47.8,54.17
  Top 0.813: IC2_ESP32S2WROOMM22S2.2 89.06,55.09 88.28,55.87 C6.1
  Top 1: 88.05,56.18 87.88,56.35 86.62,56.35 v86.5,56.48 v86.49,56.48 50,56.48 47.79,54.27 C4.1
  Bottom 0.508: v68.62,25 72.38,25 77.12,29.75 77.12,32.38 79.45,34.7 86.41,34.7 v86.53,34.58
  Bottom 0.61: v86.53,34.58 89.25,37.3 89.25,41.88 88.61,42.51 WIFI_EN.2
  Bottom 0.813: v86.5,56.48 87.5,55.48 WIFI_EN.2
5V_AUD  (via drill 0.5)  (1 unrouted)
  Top 0.406: 97.28,25.88 | 97.09,26.07 C28.1 | IC4.1 92.55,27.18 92.3,27.43 92.3,27.99 | IC4.6 96.67,25.88 97.17,25.38 | 90.54,31.88 AUD_IN.3 91.92,30.62 91.92,30.49
  Top 0.61: 92.3,27.99 92.3,30.19 91.92,30.49 90.54,31.88 | v79.62,23 79.67,22.95
  Top 0.813: C29.1 79.67,21.22 79.67,22.95 79.67,24.59
  Top 1: 97.17,26 97.17,25.38 v97.17,24.25 | 97.28,25.88 97.17,26 | 97.17,26 97.09,26.07
  Bottom 1: v97.17,24.25 97.12,24.29 97.12,28.53 95.44,30.21 91.11,30.21
  Bottom 1.016: 91.11,30.21 90.54,30.79 AUD_IN.3 90.54,30.16 87.62,27.25 86.62,27.25 82.38,23 v79.62,23
5V_EXT  (via drill 0.5)
  Top 1.016: D3.2 45.24,48.87 v45.88,49.5
  Bottom 1.016: J7.3 53.1,49.06 52.41,49.75 49.5,49.75 49.12,49.38 46,49.38 v45.88,49.5
5VC  (via drill 0.5)
  Top 0.406: 30.88,32.25 29.75,32.25 | 28.38,33.51 28.38,33.88
  Top 0.508: 29.75,32.25 28.38,33.62 | 27.38,32.5 28.38,33.51
  Top 0.813: v79.62,28 R25.1
  Top 1.016: v75.5,25.88 75.25,26.12 75.25,27.75 73.58,29.41 62.84,29.41 60,32.25 49.75,32.25 49.33,31.82 R5.1 49.33,31.8 48.62,32.5 46.38,32.5 43.95,30.07 39.05,30.07 R3.1 38.81,31.43 38,32.25 30.88,32.25 28.42,32.25 | R4.1 28.42,32.25 | 28.38,32.5 28.38,33.62 28.38,33.88 28.38,39.38 29.88,40.88 R7.1 30.88,43.01 33.52,45.65 C32.1 | 28.42,32.25 28.42,32.5 28.38,32.5 | 28.38,32.5 27.38,32.5 24.25,32.5 21.88,30.12 21.88,28.38 20.6,27.1 R6.1 | C22.2 35.31,55.75 31.77,55.75 L3.2 31.77,55.41 36.43,55.41 36.88,55.85 v37.5,55.85 35.79,55.85 C22.2
  Bottom 1.016: C32.1 37.2,51.23 37.54,51.57 37.54,55.81 v37.5,55.85 | v75.5,25.88 77.5,25.88 v79.62,28
5VD  (via drill 0.5)
  Top 1: 51,37.38 51,36.75 52.62,35.12 v67,35.12 | UART0.4 76.15,32.1 77.12,31.12 77.12,23.12 | 38.38,50.7 38.91,51.24 R8.1 38.91,51.21 v39.38,50.75 39.25,50.62 33.35,50.62 L3.1
  Top 1.016: D2.1 28,48.87 D3.1 30.23,51.01 L3.1 33.27,50.7 38.38,50.7 | 77.12,23.12 77.12,22.88 v76.25,22 | 51,37.38 51,38 50.12,38.88 46.5,38.88 45,40.38 v45,45 | C30.1 72.45,7.92 72.5,7.88 v73.38,7.88
  Bottom 1: v39.38,50.75 39.38,50.62 41.75,48.25 43.72,48.25 44.88,47.09 44.88,45.12 v45,45 | v67,35.12 67.12,35 73.25,35 74.81,33.44 UART0.4
  Bottom 1.016: v76.25,22 73.38,22 71.88,20.5 71.88,9.38 v73.38,7.88 76.12,7.88 77.62,9.38 77.62,10.92 J4_USB.1
AUD_IN
  Top 0.61: AUD_IN.1 85.08,31.62 82.95,31.62 R26.1
AUD_OUT_A  (via drill 0.2)
  Top 0.305: IC4.8 95.85,27.18 96.15,27.47
  Top 0.406: 87.67,24.66 C24.2 | 96.15,27.47 98.06,27.47 98.37,27.16 98.37,23.12 97.99,22.74 OUTA.1 97.31,21.93 96.62,21.25 95.38,21.25 92.27,18.14 AUD_DAUGHTER-B_OUT.1
  Top 0.61: v86.19,23.56 86.57,23.56 87.67,24.66
  Top 0.813: v95.5,4.38 95.5,3.11 J5_AUDIO.1
  Bottom 0.508: 92.25,16.48 92.25,14.25 91.88,13.88 88.12,13.88 86.14,15.86 86.14,23.5 v86.19,23.56
  Bottom 0.61: AUD_DAUGHTER-B_OUT.1 92.25,16.48 92.25,13.77 94.13,11.89 94.13,6 95.5,4.62 v95.5,4.38
AUD_OUT_B
  Top 0.305: IC4.5 95.72,25.1 95.72,24.73
  Top 0.406: 95.72,24.73 96.12,24.32 96.12,22.75 | 96.12,22.75 96.12,22.25 95.75,21.88 95.12,21.88 90.62,17.38 90,17.38 89.74,17.12 89.74,16.76 AUD_DAUGHTER-B_OUT.2 89.73,17.39 88.53,18.6 88.53,19.9 C23.2 | OUTB.1 96.12,22.75
  Top 0.61: J5_AUDIO.2 93.96,11.79 89.74,16.01 89.74,16.76
D+
  Top 0.305: IC1.6 72.5,14.43 72.62,14.3 76.92,14.3 J4_USB.3
D-
  Top 0.305: IC1.5 72,13.75 72.16,13.59 76.95,13.59 J4_USB.2
ESP_AUD
  Top 0.406: IC2_ESP32S2WROOMM22S2.39 86.06,36 83.46,33.4
  Top 0.508: 83.46,33.4 81.4,33.4 80.58,32.58
  Top 0.61: R27.1 80.58,32.58
GND  (via drill 0.2, 0.2 pad 0.6, 0.5, 0.6)  (2 unrouted)
  Top 0.254: U2.9 U2.8 | U2.3 23.88,8.95 23.64,8.95 | U1.9 U1.8 | 44.64,54.89 44.63,54.4 44.63,54.35 | U11.7 44.64,52.71 44.68,52.75 U11.1 45.64,52.73 45.64,51.28 | U3-IMU.7 U3-IMU.6 | 51.88,27.98 51.81,27.91 | U10-MAG_SENSOR.9 44.83,35.44 44.83,34.01 v44.73,33.92 | 46,36.69 47.4,36.69 | 47.51,36.58 C8.2 | U13-I2C.3 64.37,22.75 | U3-IMU.1 56.05,30.25 56.38,30.25
  Top 0.305: 46,36.69 45.75,36.94 U10-MAG_SENSOR.11 | U2.5 25.3,9.32 25.75,8.88 | U1.3 35.42,8.75 35.25,8.75 35.12,8.75
  Top 0.406: C2.2 25.6,10.93 U2.8 | 53.72,27.98 51.88,27.98 | IC4.7 94.67,26.52 94.54,26.65 | 94.5,28.5 94.62,28.5 v94.75,28.62 | v93.5,28.62 94.2,27.93 IC4.9 94.2,23.8 | U4.2 5.75,23.75 4.76,24.73 v4.75,24.73 | U$4.1-GND 11.88,47.88 11.88,45.03 C16.2 | C1.2 37.1,12.21 37.1,10.77 36.84,10.77 U1.8 | IC2_ESP32S2WROOMM22S2.42 90.56,36.59 91.38,35.78 v91.38,34.88
  Top 0.508: 47.51,36.58 47.4,36.69 | PS1.1 20.95,54.42 | U6.2 v24.75,28.12
  Top 0.61: 8.96,22.45 C42.2 | U13-I2C.7 65.62,19.14 64.36,20.41 U13-I2C.3 | 64.37,22.75 64.37,24.5 64.56,24.69 C13.2 | v21.5,54.98 20.95,54.42 | v93.62,23.75 v94.88,23.75 | 47.54,37.03 C8.2 | U7.2 v35.12,27.88 | U5.2 45.73,27.64 v45.66,27.7 | 39.89,27.05 38.8,28.14 | 28.45,26.8 C62.2 | 28.45,27.18 C61.2 | U12.2 31.81,37.47 30.97,38.3 v30.91,38.3 | 25.75,8.88 25.88,8.75 27.62,8.75 | 27.62,8.75 32.75,8.75 | 32.75,8.75 35.25,8.75 | 27.62,8.75 27.88,8.5 v27.88,3.25 | 32.75,8.75 32.88,8.62 v32.88,3.25 | IC2_ESP32S2WROOMM22S2.26 65.91,38.97 v65.5,39.38 63.16,39.38 UART1.3 | C15.2 31.89,25.61
  Top 0.813: U11.7 44.64,54.89 45.64,55.89 | 44.63,54.4 v43.14,55.89 | 44.64,52.71 44.64,52.38 44.58,52.31 | 42.44,51.25 v43.52,51.25 43.64,51.25 44.64,52.25 45.64,51.25 v45.77,51.25 46.64,51.25 47.69,52.3 C4.2 | 41.39,52.3 C5.2 | IC2_ESP32S2WROOMM22S2.51 86.6,48.41 90.56,52.37 IC2_ESP32S2WROOMM22S2.1 90.56,55.8 C6.2 91.44,56.18 v91.53,56.1 | IC2_ESP32S2WROOMM22S2.42 90.56,38.86 84.13,45.29 84.13,45.35 | IC2_ESP32S2WROOMM22S2.26 74.57,38.97 IC2_ESP32S2WROOMM22S2.47 | C41.2 8.71,22.51 | C42.2 10.76,22.45 | 8.77,23.7 8.77,22.57 | DLHR-L30G-E1BD-C-NAV8.1-GND 1.88,27.48
  Top 1: 27.63,56.22 27.5,56.35 v27,56.35 | C21.1 | v28.25,56.35 27.89,56.35 27.62,56.09 | v7.4,56.34 8.03,55.72 8.03,55.1 C17.1 8.01,55.12 8.01,55.73 v8.63,56.35 | 15.9,52.52 C18.1 | 15.4,51.77 15.9,52.27 16.4,51.77 v16.65,51.77 16.41,51.77 15.91,51.27 R11.1 15.91,51.26 15.4,51.77 | 15.4,51.77 v15.15,51.77 | v36.05,52.05 36.02,52.05 35.59,52.47 35.17,52.05 v34.8,52.05 | C22.1 35.6,53.15
  Top 1.016: 94.2,23.95 IC4.9 94.2,28.2 94.5,28.5 | 8.71,22.51 C42.2 8.77,22.57 | 10.76,22.45 R13.1 | 1.88,27.48 C3.2 | 39.89,27.05 v39.89,26.27 41.6,26.27 | C71.2 38.8,28.14 | v29.27,26.11 29.27,26.36 | v29.27,26.11 29.11,25.95 | C11.2 56.83,25.3 v57.38,24.75 | C12.2 37.45,38.72 v37.45,37.67 37.49,37.63 C9.2 | 52.15,28.26 v52.38,28.5 | v29.27,26.11 31.39,26.11 31.89,25.61 | C2.2 25.6,19.57 v26.25,20.23 | C1.2 37.2,19.57 v37.88,20.25 | 87.95,31.95 AUD_IN.2
  Bottom 0.254: v44.73,33.92 44.7,33.92
  Bottom 1.016: v26.25,20.23 26.25,23.09 v29.27,26.11 | v37.88,20.25 37.88,24.25 v39.89,26.27
  other vias: 62.92,26.21 46.1,55.89 11.25,24.11 46.08,37.03 81.77,49.16 94.22,26.17 98.27,30.88 84.73,46.14 83.27,46.16 81.77,46.16 81.72,44.73 80.22,47.61 83.27,49.16 84.8,47.67 83.27,47.66 81.77,47.66 80.25,46.12 83.22,44.73 93.12,22.62 94.38,22.62 93.12,21.38 91.88,22.62 91.88,21.38 91.88,20.12 92.38,23.75 26.38,3.25 34.38,3.25 35.12,22.25 33.62,22.25 25.62,17.75 37.38,17.75 46.75,21.75 45.38,21.75 74.62,23.5 75.88,23.5 74.62,24.75 75.38,29.75 65.38,33.5 65.38,32.12 86.25,29.88 84.75,29.88 97.12,30.88 87.38,18.62 87.38,17.5 87.38,16.38 82.38,19.38 81,19.38 79.62,19.38 78.25,19.38 76.88,19.38 75.62,20.25 74.25,20.25 73.5,19 75.88,15.62 83.62,18.88 83.62,17.62 83.62,16.38 83.62,15.12 84.75,14.25 85.88,13.25 86.75,12.12 86.75,10.75 86.75,9.38 86.75,8 86.75,6.62 23.38,3.38 21.88,3.38 37.5,3.25 39,3.25 1.75,50.75 3.12,50.75 4.5,50.75 5.88,50.75 7.25,50.75 8.62,50.75 10,50.75 11.38,50.75 12.38,49.75 13.25,48.88 14.12,48 14.12,46.75 26.25,50.62 27.5,50.62 28.75,50.62 18.38,56.38 5.88,56.12 5.88,55 41.5,50.5 48,50.88 51.5,55.12 50.62,54.38 59.38,52.25 59.38,50.88 59.38,49.5 60.12,46.38 61.12,47.38 62,48.25 62.88,49.12 62.76,46.09 63.64,46.93 64.52,47.86 60.5,44.12 60.5,42.75 60.5,41.38 60.5,40 60.5,38.5 60.5,37.12 49.5,37.38 49.5,36.12 49.5,34.88 49.5,33.62 50.75,33.62 52.12,33.62 53.5,33.62 54.88,33.62 56.25,33.62 57.62,33.62 59,33.62 60.38,33.62 62.12,33.62 62.12,32.25 38.75,47.5 40.25,47.5 34.5,47.38 33.25,47.38 32,47.38 30.75,47.38 29.5,47.38 28.25,47.38 29.5,45.5 25.75,45.5 24.38,45.5 24.38,44.25 43.38,43.88 41.12,43.88 39.5,43.88 40.75,41.38 29.73,34.37 29.73,35.74 29.73,37.12 40.5,31.42 41.88,31.42 43.25,31.42 44.75,32.75 51.5,30.88 52.75,30.88 54,30.88 55.25,30.88 56.5,30.88 57.75,30.88 59,30.88 51.12,29.75 40.62,28.75 42.25,28.75 43.88,28.75 45.62,29.5 43.62,26.25 42.38,26.25 23.75,22.25 13.66,25.7 16.38,25.5 16.5,28.88 19.88,28.88 19.5,25.62 20.88,25.62 24.75,31 23.88,30 23.38,28.75 22.12,26.5 13.62,32.38 15.25,32.38 16.75,32.38 14.87,28.86 13.12,28.86 11.37,28.86 11.04,31.3 5.62,31.88 6.75,27.72 3.25,32 1.88,25.62 3.25,25.62 12.25,18.88 13.5,18.88 12.25,15.25 13.5,15.25 13.5,17 12.25,17 9.25,18.88 9.25,17 9.25,15.25 13.62,12.75 7.75,18.88 7.75,17 7.75,15.25 8.38,38.25 10.62,38.25 10.62,39.5 11.38,46.75 12.75,46.75 11.38,45.38 12.12,44.12 12.12,42.62 12.12,40.88 10.62,40.88 6.75,43.62 4.38,43.62 4.38,42 4.38,38.88 5.62,34 8.25,34 10.75,34 3.12,34 3,38.25 1.88,43.62 7.38,6.62 9.62,6.62 27.25,17.75 38.88,17.75 56.38,21.75 55,21.75 53.62,21.75 52.25,21.75 50.88,21.75 49.5,21.75 48.12,21.75 44,21.75 41.38,21.25 65.12,19.75 67.12,21 64,20.75 61.75,21.25 61.75,19.25 66.12,15.88 68,14.5 64.75,15.88 63.38,15.88 61.88,15.88 60.38,15.88 59.12,14.5 58.25,19.38 57.38,22.62 58.25,23.62 61.01,24.76 65.5,24.62 62.62,24.75 64.25,27.88 62.62,27.88 68.88,23.5 68.88,22.25 70.25,19.75 70.25,18.5 70.25,17.12 70.25,15.75 70.25,14.38 70.25,13 70.25,11.62 73.5,12.25 74.75,12.25 76,12.25 79.12,15.88 79.12,14 79.12,12.25 70.25,10.38 70.25,8.88 58.5,11.25 58.5,9.75 58.5,8.25 58.5,6.75 58.5,5.25 58.5,3.75 58.5,2.25 56,19 51.09,19.07 49.12,19 47.62,19 46.12,19 44.62,19 98.12,21 84,26.88 16.75,33.75 16.75,35.12 16.75,36.62 16.75,38.12 16.75,39.62 16.75,41.12 16.75,42.62 16.75,44.12 16.75,45.62 15.5,46.62 18.5,46.12 18.5,44.62 18.5,43 20,43.5 21.5,43.5 23,43.5 26.75,39 25.12,39 23.62,39 22,39 26.75,37.5 26.75,36 26.75,34.25 24.88,34.25 23,34.25 21.25,34.25 21.25,35.88 21.25,37.5 21.25,32.62 30.25,30.5 31.88,30.5 33.5,30.5 35.12,30.5 30.88,26.12 32.5,26.12 33.5,27.88 30.25,29 30.25,27.5 22.25,23.25 20.88,23.25 19.5,23.25 22.25,24.75 16.38,23.75 16.38,21.75 16.38,19.88 16.38,17.88 16.38,16 16.38,12.62 16.38,11 16.38,9.12 16.38,7.25 15.12,5.75 15.12,4.12 12.62,4 12.62,2 16.62,3.38 10.75,4 8.75,4 12.75,9.75 12.75,7.75 49.25,7.5 49.25,4.88 46.5,4.88 46.5,7.5 50.38,12 55.12,12 56.38,13.5 48,10.62 50.88,9.25 53.25,9.38 55.88,9.38 57.75,17.25 56.38,23.62 54.75,23.62 53,23.62 52.38,29.75 61.01,27.89 61.01,26.26 93.75,14.75 95.38,14.12 97.5,12.88 97.5,11.38 92,7.62 97.5,8.5 97.5,9.88 97.5,7 97.5,5.62 93.62,4.5 97.5,4.25 97.5,2.88 88.25,2 86.5,2 84.88,2 84.88,3.75 84.88,5.25 85.38,6.62 88.12,12.62 89.62,12.62 70.25,7.38 70.25,5.88 70.25,4.38 70.25,3 70.25,1.62 64.88,13.38 64.88,11.88 62.62,7.75 68.62,9.25 67,9.25 63.25,5.38 60.5,2.25 62.5,2.25 68.75,5.38 67.12,5.38 65.5,5.38 49.25,2.12 44.88,3.25 52.88,12.12 40.5,19 28.88,19 19.25,20.62 20.75,19.5 32.38,19 61.88,36.5 63.25,37.25 65.5,40.75 59.12,36.5 57.75,36.5 56.38,36.5 55,36.5 53.62,36.5 52.62,37.62 51.38,39.88 52.62,39 46.31,46.5 39,56.25 40.38,56.25 41.75,56.25 47.5,56.25 29.25,42.88 27.62,42.88 26,42.88 24.38,42.88 29.88,44.25 30.88,45.25 32,46.25 39.5,46.38 39.5,45.12 9.25,41.62 3,40 1.88,41.88 1.75,37.5 1.75,34.88 28.25,45.5 27,45.5 24.88,36.75 22.88,36.75 18.5,41.38 12.62,33.88 12.62,36 12.62,38.12 33,43.12 34.38,43.12 35.75,43.12 37,43.12 38.25,43.12 43.5,39.62 44.75,38.5 50.75,34.88 46,33.88 70.38,45.75 71.5,44.62 71.5,43.25 70.38,42 70.38,39.88 41.12,26.25 51.12,28.5 43.89,27.52 40.62,27.5 35.12,29.18 31.88,27.5 37.5,39 36.25,39 36.17,37.67 44.62,55.88 44.64,51.25 42.62,50.5 46.88,50.88 21.5,53.85 52.38,27.25 51.12,27.25 41.12,34.75 6.75,4 4.62,4 2.62,4 11.5,11.25 6.12,14.62 5,13.5 3.88,12.38 2.75,11.25 3.25,24.25 3.25,22.88 3.25,21.5 6.38,18.88 10.12,24.12 14.62,44.88 14.62,41.75 14.62,38.5 14.62,34.88 54.88,38.62 57.62,38.62 57.38,26.12 58.5,28.38 4.62,6.75 48,13.62 48,16.5 56.5,2.25 51.5,2.12 72.62,5.88 75.38,5.88 78.12,5.88 80.38,5.88 82.88,5.88 89.62,52.75 90.88,38.88 90.88,40.62 90.88,42.62 89.12,44 89.12,47.12 89.12,50.12 86,43.88 84.88,39.88 84.88,42.5 86,47.12 86,50.25 73.38,39.75 76.38,39.88 79.25,39.88 82.25,39.88 70.38,50.25 70.38,47.62 71.88,51.62 74.88,51.75 77.75,51.62 80.88,51.62 84,51.62 90.75,45.38 90.62,48.62 90.62,51.38 59.12,44.12 31.62,50.5 31.88,29 33.5,29.18 42.25,27.5 79.25,7.12 79.25,8.5 45,35 38.5,33.5 90.49,18.68 44.64,53.26 84.25,21.25 78.62,29.5 78.5,31.75 76.5,33.5 80.71,28.79 84.25,20
  pour Bottom (isolate 0.254): 0,0 100,0 100,31.75 92,31.75 92,58 0,58
  pour Top (isolate 0.2): 0,58 92,58 92,31.75 99.88,31.75 99.88,0 0.25,0 0,-0.25
IO
  Top 0.254: U13-I2C.2
  Top 0.406: U13-I2C.2 65.62,21.12 66.75,20 67.75,20 68.12,19.62 68.12,16.38 66.5,14.75 64.5,14.75 63,13.25 63,10.62 60.85,8.47 J6_OAT.3-R
N$2
  Top 0.254: U10-MAG_SENSOR.10 45.02,36.44 | C8.1 47.52,35.15
  Top 0.305: 45.02,36.44 46.31,35.15
  Top 0.813: 47.52,35.15 46.31,35.15
N$7
  Top 0.508: IC2_ESP32S2WROOMM22S2.41 89.06,36.56 89.53,36.1 R10.1
N$8
  Top 0.406: IC4.4 91.8,25.23 91.05,24.48 91.05,23.3 90.17,22.43 R15.2 90.12,20.3 C23.1
N$9  (via drill 0.5)
  Top 1.016: L1.1 11.86,52.31 C17.2
  Top 1.27: v13.62,51 12.23,52.39 L1.1
  Bottom 1.27: D1.C 18.15,50.52 17.38,49.75 14.88,49.75 v13.62,51
N$13
  Top 0.406: PS1.3 18.22,53.38 19.17,52.43 PS1.5
  Top 0.61: PS1.3 18.22,54.78 17.2,55.8 C18.2
  Top 1.016: L1.2 12.03,55.67 15.78,55.67 C18.2
N$15
  Top 0.61: C25.1 82.8,27.93 82.8,29.72 R26.2 81.12,29.8 R27.2
N$16
  Top 0.813: 20.65,47.16 20.07,47.74 18.32,47.74 R12.2
  Top 1: R12.2 16.46,47.87 R11.2
  Top 1.016: 20.65,47.16 C20.2 R9.1
N$17
  Top 0.61: L2.1 23.48,56.03 19.73,56.03 19.17,55.47 PS1.2 19.17,53.73 19.7,53.2 20.5,53.2 21.3,52.4 21.3,51.8 22.57,50.53 C19.1
N$18
  Top 0.61: PS1.4 18.22,50.26 R12.1
N$20
  Top 0.61: PS1.6 20.12,50.38 C19.2
N$21
  Top 0.406: IC4.3 90.78,25.88 R14.2
  Top 0.508: R14.2 C24.1
N$22
  Top 0.61: 85.94,25.5 C26.2
  Top 0.813: R14.1 87.21,26.77 85.94,25.5
N$23
  Top 0.61: R15.1 87.85,22.05 85.4,22.05 82.82,24.63 C25.2
N$24
  Bottom 1.27: 12V_IN.1 6.88,52.95 F1.1
N$25  (via drill 0.2)
  Top 0.508: IC2_ESP32S2WROOMM22S2.40 87.5,37.03 v87.5,39
  Bottom 0.508: 87.32,40.75 WIFI_EN.1
  Bottom 0.813: v87.5,39 87.5,40.75 87.32,40.75
N$26
  Top 0.406: 92.47,26.52 IC4.2 92.8,26.53 91.84,26.53 | 90.75,28.25 C27.1
  Top 0.508: 91.25,27.12 91.84,26.53
  Top 0.61: C27.1 91.12,29.25 91.25,29.25
  Top 0.813: 91.25,29.25 91.25,27.12
N$27
  Top 0.305: IC1.1 72.51,17.51 72,18.02 72,21.3 72.62,21.93 R17.1
N$28
  Top 0.305: IC1.2 72,17.25 71.36,17.89 71.36,21.27 R16.1
N$32
  Bottom 1.27: F1.2 12.19,54.12 13.97,54.12 D1.A
N$33
  Top 0.508: D2.2 24.93,48.59
  Top 0.813: 24.9,52.07 24.52,52.45 L2.2 | D2.2 24.93,48.55 23.93,47.55 R9.2
  Top 1.016: R9.2 C20.1 | L2.2 24.48,52.45 24.73,52.2 27.59,52.2 C21.2 | 24.9,48.86 D2.2 24.93,52.05 24.52,52.45
SCL0  (via drill 0.2, 0.5)
  Top 0.254: U3-IMU.13 56.67,28.45 57.22,27.89 | U1.2 34.43,9.62 33.91,10.13 | U2.2 22.88,9.88 22.5,10.25
  Top 0.305: U10-MAG_SENSOR.1 40.75,38.23
  Top 0.508: 40.75,38.23 40.75,39.62 38.96,41.41 v38.96,41.83
  Top 0.61: R2.2 v50.88,45.39 51.14,45.39 52.5,46.75 52.5,52.5 53.43,53.43 64.68,53.43 v64.75,53.5 64.83,53.42 65.7,53.42 66.66,52.47 IC2_ESP32S2WROOMM22S2.17 | v50,20.24 57.04,20.24 59.41,22.61 | U13-I2C.4 59.53,22.73 59.41,22.61 | 59.41,22.61 59.41,25.7 57.22,27.89 | 33.91,10.13 33.66,10.38 v33.66,20.24 | v18.3,21.99 20.05,21.99 22.12,19.92 22.12,13.12 | 22.5,10.25 22.12,10.63 22.12,13.12 | U$1.4-SCL 3.38,10 7.38,14 17.25,14 18.12,13.12 22.12,13.12
  Bottom 0.406: U$4.4-SCL 3.15,48.98 3.15,41.6 4.06,40.69 8.19,40.69 9.48,39.4 9.48,30.14 DLHR-L30G-E1BD-C-NAV8.4-SCL
  Bottom 0.61: SJ2-I2C.1 64.53,52.9 64.75,53.12 v64.75,53.5 | v50,20.24 49.96,20.2 39.84,20.2 38.62,18.99 37.04,18.99 35.79,20.24 v33.66,20.24 28.29,20.24 27.04,18.99 25.3,18.99 22.3,21.99 v18.3,21.99 18.24,21.99 18.24,29.99 | v50.88,45.39 50.88,45.26 48.25,42.62 39.76,42.62 v38.96,41.83 38.73,41.6 20.98,41.6 18.24,38.87 18.24,29.99 | DLHR-L30G-E1BD-C-NAV8.4-SCL 18.11,30.12 18.24,29.99
SCL1  (via drill 0.5)
  Top 0.406: J7.5 55.87,45.25 60.5,45.25 v64.5,49.25
  Top 0.61: IC2_ESP32S2WROOMM22S2.19 64.72,49.47 v64.5,49.25 | R24.2 51.33,43.25 J7.5
  Bottom 0.61: SJ2-I2C.2 64.53,49.27 v64.5,49.25
SDA0  (via drill 0.2, 0.5)
  Top 0.254: U3-IMU.14 55.81,28.95 56.19,29.32
  Top 0.305: v42.3,40.94 42.18,40.81 U10-MAG_SENSOR.16 | U2.4 24.75,8.38 | U1.4 36.25,8.38
  Top 0.406: U$4.3-SDA 5.7,48.98 5.7,38.3 6.95,37.05 DLHR-L30G-E1BD-C-NAV8.3-SDA | 56.19,29.32 59.48,29.32 v59.59,29.2 | v61.75,54.88 61.8,54.92 61.88,54.92
  Top 0.508: v19.93,30.92 12.95,30.92 11.25,32.62 8.25,32.62 6.96,31.33 DLHR-L30G-E1BD-C-NAV8.3-SDA | 36.25,8.38 36.25,1.96 | 24.75,8.38 24.75,1.96
  Top 0.61: IC2_ESP32S2WROOMM22S2.16 67.61,54.92 61.88,54.92 52.92,54.92 51,53 51,48.25 50.34,47.59 R1.2 50.84,47.59 v51,47.75 | 60.25,17.82 U13-I2C.5 | 60.25,17.82 v60.25,19.25 | U$1.3-SDA 5.92,10.04 8.25,12.38 12.38,12.38 13.88,10.88 13.88,2.88 14.79,1.96 24.75,1.96 36.25,1.96 46.21,1.96 47.88,3.62 47.88,8.5 50,10.62 55.88,10.62 57.62,12.38 57.62,15.25 60.2,17.82 60.25,17.82
  Bottom 0.508: v42.3,40.94 41.55,40.19 21.7,40.19 19.93,38.42 v19.93,30.92
  Bottom 0.61: v61.75,54.88 61.7,54.83 I2C_LINK.1 | v60.25,19.25 59.59,19.91 v59.59,29.2 | v42.3,40.94 48.81,40.94 52.57,44.7 52.57,46.68 51.5,47.75 v51,47.75 | U$1.3-SDA 5.92,5.96 6.62,5.25 12,5.25 14.88,8.12 14.88,26.38 13.88,27.38 8.75,27.38 6.96,29.17 DLHR-L30G-E1BD-C-NAV8.3-SDA
SDA1  (via drill 0.2, 0.5)
  Top 0.61: J7.6 58.4,46.52 v62.25,50.38 62.88,51 67.28,51 IC2_ESP32S2WROOMM22S2.18 | R23.2 51.5,41.12 v51.62,41.25
  Bottom 0.406: J7.6 57.14,46.27 55.87,45 55.87,43.12 55.47,42.72 53.05,42.72 51.62,41.3 v51.62,41.25
  Bottom 0.61: I2C_LINK.2 61.7,51.42 62.25,50.88 v62.25,50.38
U0RXD
  Top 0.508: UART0.2 69.73,32.98 71.36,34.61 82.85,34.61 84.56,36.32 IC2_ESP32S2WROOMM22S2.38
U0TXD
  Top 0.508: UART0.1 67.19,32.19 70.35,35.35 82.39,35.35 83.06,36.02 IC2_ESP32S2WROOMM22S2.37
U1RXD
  Top 0.508: IC2_ESP32S2WROOMM22S2.21 66.37,46.47 65.62,45.73 65.62,43.12 64.45,41.95 UART1.2
U1TXD
  Top 0.508: IC2_ESP32S2WROOMM22S2.20 66.17,47.97 63.1,44.9 63.1,44.49 UART1.1
USB_D+  (via drill 0.2)
  Top 0.508: v70.5,26.62 70.62,26.5 70.62,24 R16.2
  Top 0.61: IC2_ESP32S2WROOMM22S2.23 67.34,43.5 v68.75,43.5
  Bottom 0.508: v68.75,43.5 69.25,43 69.25,41.25 63.36,35.36 63.36,30.64 67.3,26.7 70.5,26.7 v70.5,26.62
USB_D-  (via drill 0.2)
  Top 0.508: v71.62,26.62 71.62,25.2 72.62,24.2 R17.2
  Top 0.61: IC2_ESP32S2WROOMM22S2.22 68.72,44.97 v68.75,45
  Bottom 0.508: v68.75,45 69,45 70.13,43.87 70.13,40.76 64.25,34.88 64.25,31 67.75,27.5 71,27.5 71.62,26.88 v71.62,26.62
VDD1
  Top 0.254: U7.5
  Top 0.61: C72.1 38.19,23.86 U7.5
  Top 0.813: C72.1 38.8,23.93 39.33,24.45 R20.1
VDD1F
  Top 0.254: 35.4,10.12 35.4,10.18 | U1.10 35.4,10.68 35.4,10.38 35.4,10.18 | U1.5 37.05,9.07 U1.6 36.5,9.62 36,10.12 U1.1 35.4,10.18
  Top 0.406: C1.1 35.4,12.21 35.4,10.68
  Top 0.813: R20.2 C14.1
  Top 1.016: C1.1 35.49,19.92 37.25,21.68 39.5,21.68 R20.2
VDD1P
  Top 0.406: U7.1 36.08,25.45 35.5,24.88 34.75,24.88 34.12,25.5 34.12,26.09 U7.3 | 36.58,27.42 36.92,27.76 C71.1
  Top 0.61: U7.1 36.08,26.91 36.58,27.42 36.84,27.68
  Top 1.016: C71.1 R3.2
VDD2
  Top 0.61: U6.5 27.41,23.86 C62.1
  Top 1.016: C62.1 28.68,24.05 28.95,24.32 R19.1
VDD2F
  Top 0.254: U2.10 23.9,10.93 23.9,10.38 U2.1 24.5,10.38 25,9.88 U2.6
  Top 0.406: 23.9,10.93 C2.1
  Top 1.016: C15.1 R19.2 29.5,22.43 28.75,21.68 25.5,21.68 23.9,20.07 C2.1
VDD2P
  Top 0.406: U6.1 25.7,25.45 25.12,24.88 24.38,24.88 23.75,25.5 23.75,26.09 U6.3
  Top 0.508: C61.1 26.36,28.57 26.36,28.8
  Top 0.61: U6.1 25.7,27.09 26.36,27.75 26.36,28.8 | R4.2 26.55,30.64
  Top 1.016: R4.2 26.52,28.41 C61.1
VDD3
  Top 0.254: 46.64,23.26 46.68,23.3 46.68,23.52
  Top 0.508: 48.67,23.8 U5.5 46.68,23.52
  Top 0.61: 48.67,23.8 C52.1
  Top 1.016: C52.1 51.06,23.86 R18.1
VDD3F
  Top 0.254: U3-IMU.5 54.48,28.95 54.84,28.59 54.84,28.07 54.97,27.95 U3-IMU.12 55.61,27.99 55.82,27.99 56.25,27.56 56.25,27 55.75,26.5 53.91,26.5
  Top 0.305: U3-IMU.8 53.91,26.5 53.91,25.5
  Top 0.406: 53.91,25.5 C11.1
  Top 1.016: C11.1 53.59,25.2 53.55,25.2 53,25.75 51.05,25.75 R18.2
VDD3P
  Top 0.406: U5.1 46.68,25.43 46.12,24.88 45.38,24.88 44.75,25.5 44.75,26.05 U5.3
  Top 0.61: U5.1 46.68,26.8 47.5,27.62 47.5,28.25 C51.1
  Top 1.016: R5.2 47.42,28.32 47.5,28.25
VDD4
  Top 0.61: U4.5 8.54,20.66 8.66,20.52
  Top 0.813: 8.66,20.52 R13.2 12.97,20.52
  Top 1.016: 8.66,20.52 C42.1 | 12.97,20.52 R21.1
VDD4F  (via drill 0.2)
  Top 0.406: U$4.2-VS 8.23,48.98 8.23,43.42 | 8.23,43.42 8.21,43.44 8.21,43.06 7.12,41.98 v7.12,38.88 | 8.23,43.42 C16.1
  Top 1.016: DLHR-L30G-E1BD-C-NAV8.2-VS 4.42,28.01 C3.1 | R21.2 v13,24
  Bottom 0.406: DLHR-L30G-E1BD-C-NAV8.2-VS 4.4,30.14 4.4,37.27 6,38.88 v7.12,38.88
  Bottom 1.016: U$1.2-VCC 8.46,11.62 10.71,13.88 10.71,20.83 13.12,23.25 13.12,23.88 v13,24 13,24.36 11.73,25.62 6.75,25.62 4.42,27.96 DLHR-L30G-E1BD-C-NAV8.2-VS
VDD4P
  Top 0.305: U4.1 6.71,22.08 6.38,21.75 5.25,21.75 4.8,22.2 U4.3
  Top 0.61: U4.1 6.71,24.84 C41.1
  Top 1.016: R6.2 8.1,27.1 6.75,25.75 6.75,25.01 C41.1
VDD5
  Top 0.61: U12.5 34.62,34.23 C10.1
  Top 1.016: R22.1 34.8,34.05 C10.1
VDD5F
  Top 0.254: 41.47,32.84 C7.1
  Top 0.305: U10-MAG_SENSOR.4 40.62,35.94 | 40.62,35.94 39.26,35.94 C9.1 | 40.62,35.94 40.62,36.75 40.81,36.94 U10-MAG_SENSOR.2 42.93,36.94 43.68,37.7 U10-MAG_SENSOR.13
  Top 1.016: 41.47,32.84 41.03,32.84 39.05,34.83 C9.1 38.93,35.86 36.97,35.86 R22.2
VDD5P
  Top 0.406: U12.1 32.77,35.77 32.34,35.34 31.29,35.34 30.86,35.76 U12.3
  Top 0.61: U12.1 C12.1
  Top 1.016: C12.1 32.76,40.09 R7.2
VDD_DIGP
  Top 0.254: U11.4 42.8,53.75 | 42.8,53.75 42.34,54.21 C5.1 | U11.6 42.91,52.75 42.8,52.86 42.8,53.75
  Top 1: R8.2 38.95,54.21 C5.1

### Text on the board
tNames: GND-TX-RX | DLHR-L30G-E1BD-C-NAV8 | IN - GND - 5V | TX-RX-GND-5V | AMS-5915
bNames: DM/dD | 12V-GND